# EAGLE design dev-board (EAGLE 9.6.2)
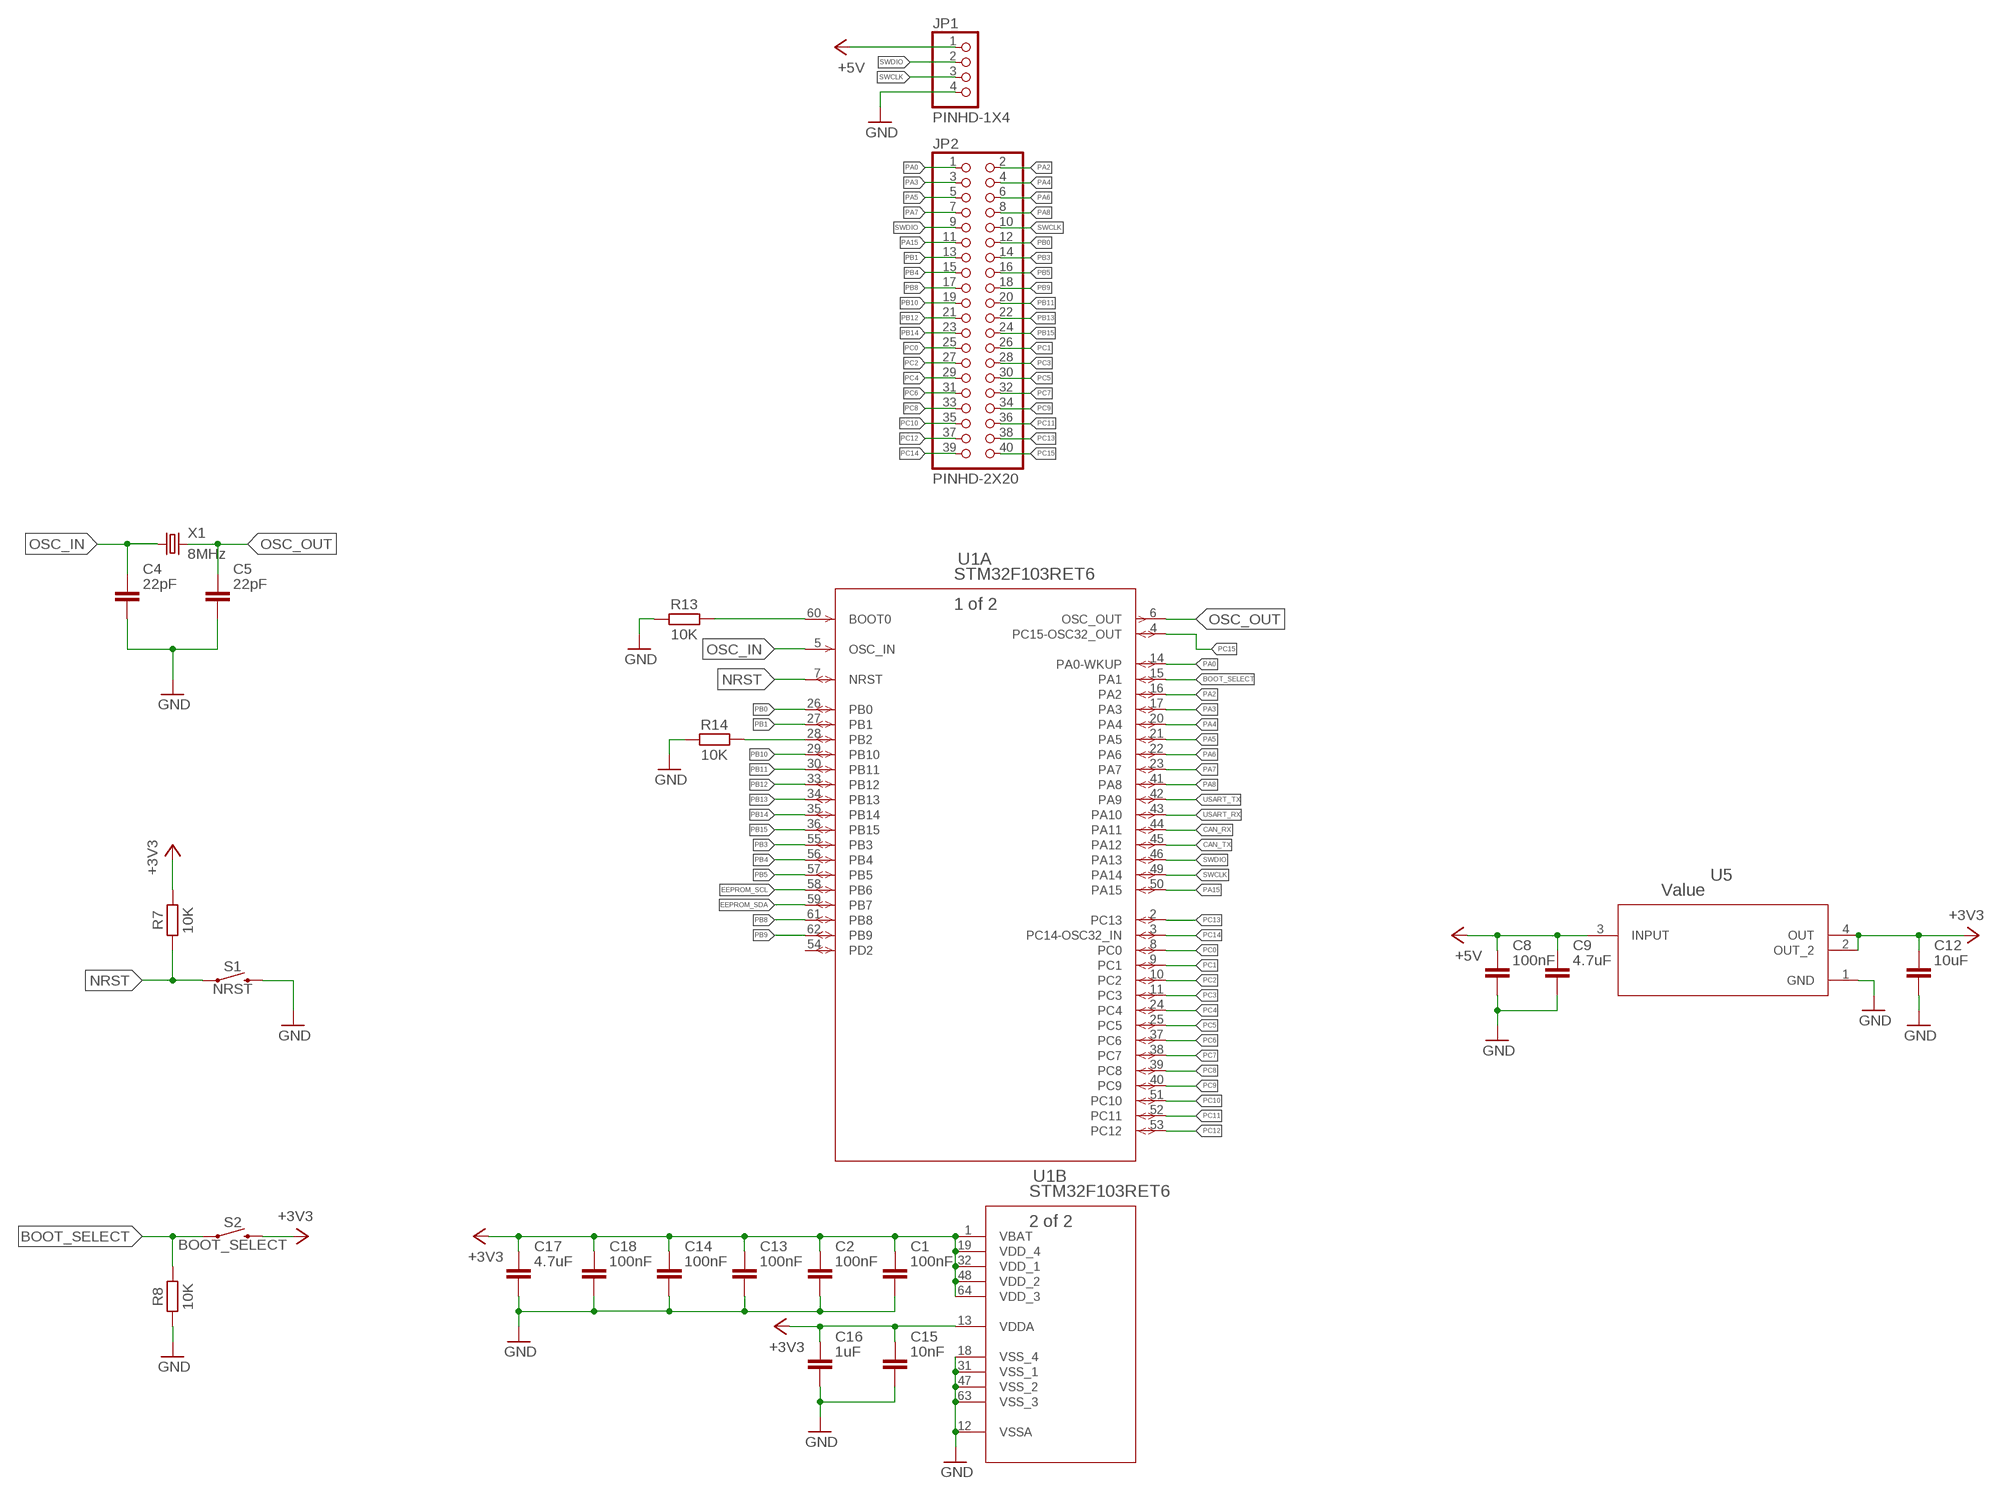
[diagram p0: schematic, sheet 1, part 1 of 2]
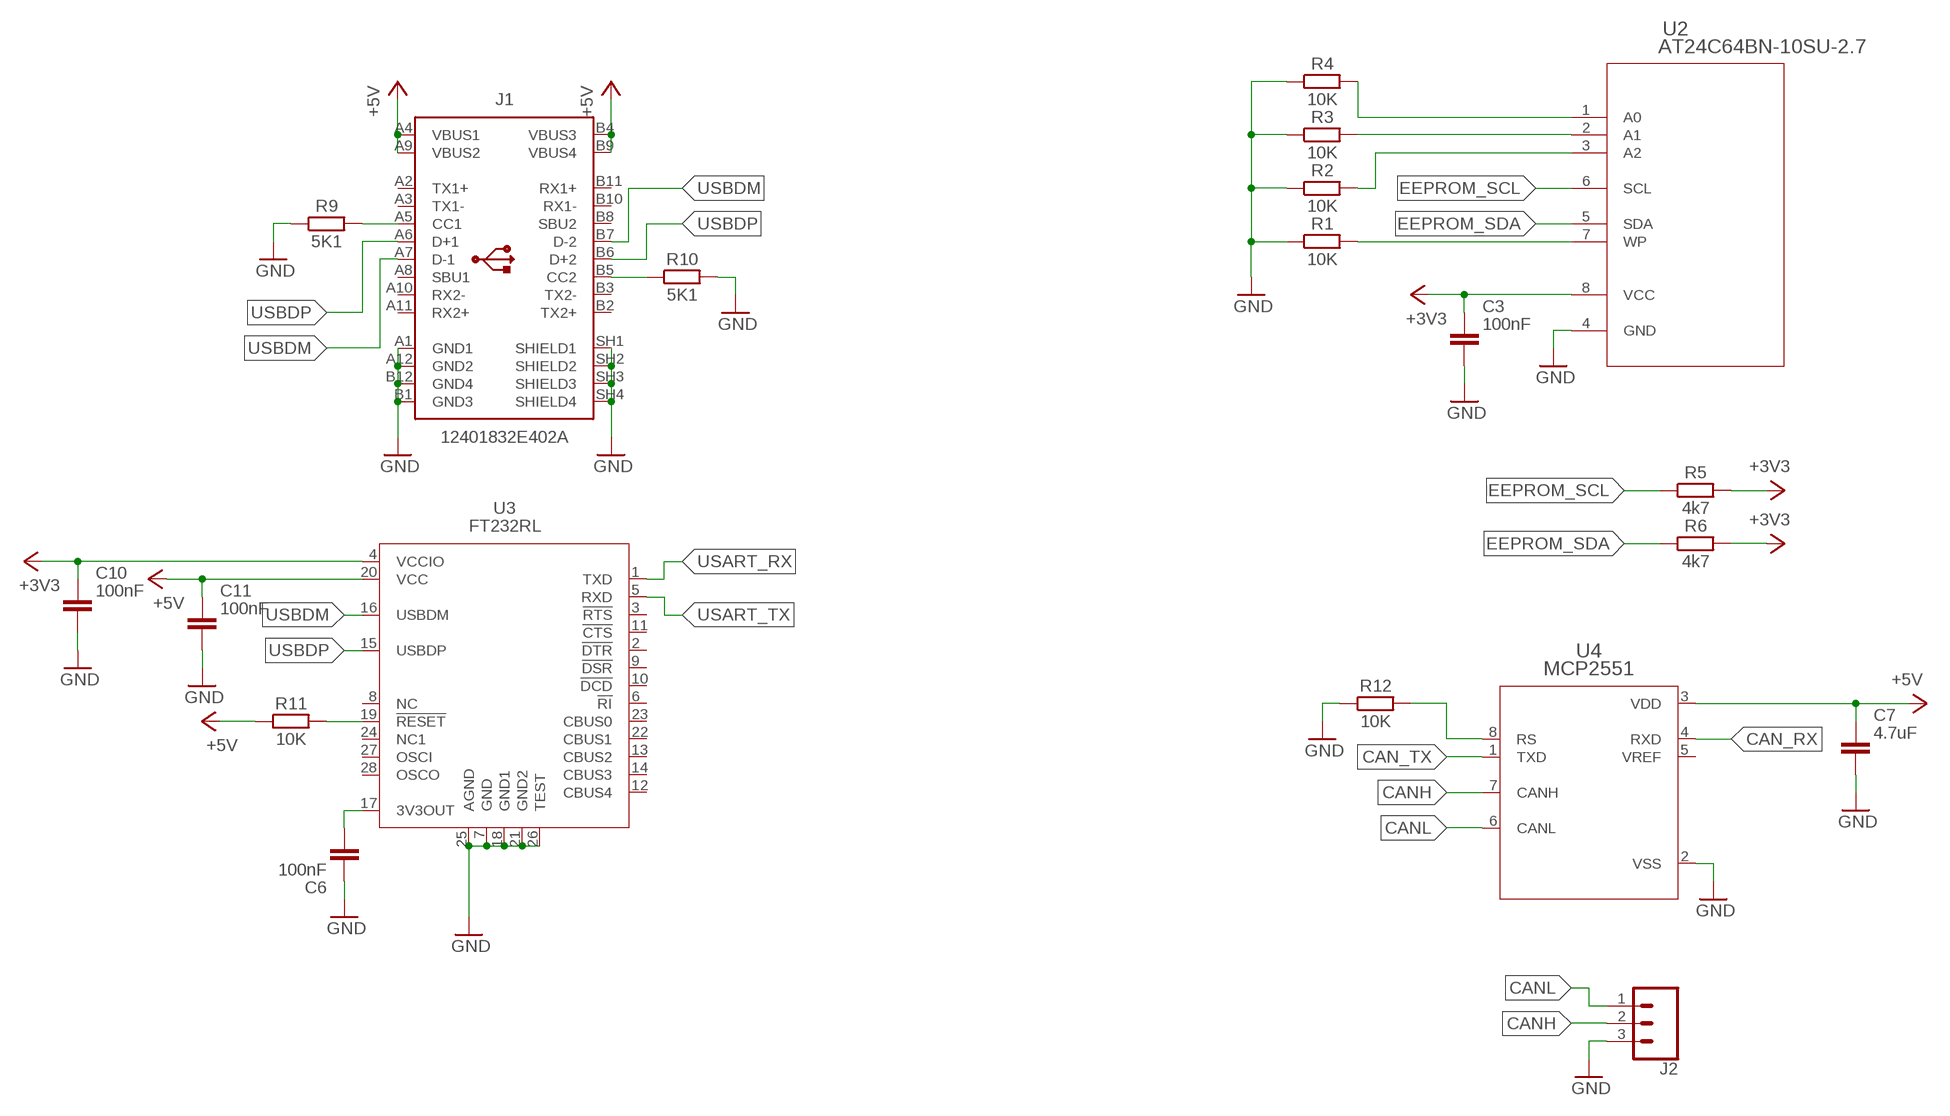
[diagram p1: schematic, sheet 1, part 2 of 2]

## Parts
C1  100nF  C_CHIP-0805(2012-METRIC)  [CAPC2012X110]
C2  100nF  C_CHIP-0805(2012-METRIC)  [CAPC2012X110]
C3  100nF  C_CHIP-0805(2012-METRIC)  [CAPC2012X110]
C4  22pF  C_CHIP-0805(2012-METRIC)  [CAPC2012X110]
C5  22pF  C_CHIP-0805(2012-METRIC)  [CAPC2012X110]
C6  100nF  C_CHIP-0805(2012-METRIC)  [CAPC2012X110]
C7  4.7uF  C_CHIP-0805(2012-METRIC)  [CAPC2012X110]
C8  100nF  C_CHIP-0805(2012-METRIC)  [CAPC2012X110]
C9  4.7uF  C_CHIP-0805(2012-METRIC)  [CAPC2012X110]
C10  100nF  C_CHIP-0805(2012-METRIC)  [CAPC2012X110]
C11  100nF  C_CHIP-0805(2012-METRIC)  [CAPC2012X110]
C12  10uF  C_CHIP-0805(2012-METRIC)  [CAPC2012X110]
C13  100nF  C_CHIP-0805(2012-METRIC)  [CAPC2012X110]
C14  100nF  C_CHIP-0805(2012-METRIC)  [CAPC2012X110]
C15  10nF  C_CHIP-0805(2012-METRIC)  [CAPC2012X110]
C16  1uF  C_CHIP-0805(2012-METRIC)  [CAPC2012X110]
C17  4.7uF  C_CHIP-0805(2012-METRIC)  [CAPC2012X110]
C18  100nF  C_CHIP-0805(2012-METRIC)  [CAPC2012X110]
J1  12401832E402A  [12401832E402A]
J2  CONN_03-SCREW-5MM  [SCREWTERMINAL-5MM-3]
JP1  PINHD-1X4  [1X04]
JP2  PINHD-2X20  [2X20]
R1  10K  R_CHIP-0805(2012-METRIC)  [RESC2012X65]
R2  10K  R_CHIP-0805(2012-METRIC)  [RESC2012X65]
R3  10K  R_CHIP-0805(2012-METRIC)  [RESC2012X65]
R4  10K  R_CHIP-0805(2012-METRIC)  [RESC2012X65]
R5  4k7  R_CHIP-0805(2012-METRIC)  [RESC2012X65]
R6  4k7  R_CHIP-0805(2012-METRIC)  [RESC2012X65]
R7  10K  R_CHIP-0805(2012-METRIC)  [RESC2012X65]
R8  10K  R_CHIP-0805(2012-METRIC)  [RESC2012X65]
R9  5K1  R_CHIP-0805(2012-METRIC)  [RESC2012X65]
R10  5K1  R_CHIP-0805(2012-METRIC)  [RESC2012X65]
R11  10K  R_CHIP-0805(2012-METRIC)  [RESC2012X65]
R12  10K  R_CHIP-0805(2012-METRIC)  [RESC2012X65]
R13  10K  R_CHIP-0805(2012-METRIC)  [RESC2012X65]
R14  10K  R_CHIP-0805(2012-METRIC)  [RESC2012X65]
S1  NRST  MOMENTARY-SWITCH-SPST-SMD-6.0X3.5MM  [TACTILE_SWITCH_SMD_6.0X3.5MM]
S2  BOOT_SELECT  MOMENTARY-SWITCH-SPST-SMD-6.0X3.5MM  [TACTILE_SWITCH_SMD_6.0X3.5MM]
U1  STM32F103RET6  [LQFP64-10X10MM]
U2  AT24C64BN-10SU-2.7  [8S1_ATM]
U3  FT232RL  FT232RL_SSOP  [SSOP28]
U4  MCP2551  MCP2551_SOIC  [SOIC127P599X175-8]
U5  Value  LM1117IMP-3.3/NOPB  [DCY0004A_N]
X1  8MHz  CRYSTALS-NOGND-4-HSMX  [HC49-4-HSMX]

## Nets
+3V3: C1.1 C2.1 C3.1 C10.1 C12.1 C13.1 C14.1 C15.1 C16.1 C17.1 C18.1 R5.2 R6.2 R7.2 S2.2 U1.1(B:VBAT) U1.13(B:VDDA) U1.19(B:VDD_4) U1.32(B:VDD_1) U1.48(B:VDD_2) U1.64(B:VDD_3) U2.8(VCC) U3.4(VCCIO) U5.2(OUT_2) U5.4(OUT)
+5V: C7.1 C8.1 C9.1 C11.1 J1.A4(VBUS1) J1.A9(VBUS2) J1.B4(VBUS3) J1.B9(VBUS4) JP1.1 R11.1 U3.20(VCC) U4.3(VDD) U5.3(INPUT)
BOOT_SELECT: R8.2 S2.1 U1.15(A:PA1)
CAN_RX: U1.44(A:PA11) U4.4(RXD)
CAN_TX: U1.45(A:PA12) U4.1(TXD)
CANH: J2.2 U4.7(CANH)
CANL: J2.1 U4.6(CANL)
EEPROM_SCL: R5.1 U1.58(A:PB6) U2.6(SCL)
EEPROM_SDA: R6.1 U1.59(A:PB7) U2.5(SDA)
GND: C1.2 C2.2 C3.2 C4.2 C5.2 C6.1 C7.2 C8.2 C9.2 C10.2 C11.2 C12.2 C13.2 C14.2 C15.2 C16.2 C17.2 C18.2 J1.A1(GND1) J1.A12(GND2) J1.B1(GND3) J1.B12(GND4) J1.SH1(SHIELD1) J1.SH2(SHIELD2) J1.SH3(SHIELD3) J1.SH4(SHIELD4) J2.3 JP1.4 R1.1 R2.1 R3.1 R4.1 R8.1 R9.1 R10.2 R12.1 R13.1 R14.1 S1.2 U1.12(B:VSSA) U1.18(B:VSS_4) U1.31(B:VSS_1) U1.47(B:VSS_2) U1.63(B:VSS_3) U2.4(GND) U3.7(GND) U3.18(GND1) U3.21(GND2) U3.25(AGND) U3.26(TEST) U4.2(VSS) U5.1(GND)
N$1: R2.2 U2.3(A2)
N$2: R3.2 U2.2(A1)
N$3: R4.2 U2.1(A0)
N$4: R1.2 U2.7(WP)
N$5: R12.2 U4.8(RS)
N$6: R14.2 U1.28(A:PB2)
N$9: R13.2 U1.60(A:BOOT0)
N$10: C6.2 U3.17(3V3OUT)
N$13: J1.A5(CC1) R9.2
N$15: R11.2 U3.19(!RESET)
N$17: J1.B5(CC2) R10.1
NRST: R7.1 S1.1 U1.7(A:NRST)
OSC_IN: C4.1 U1.5(A:OSC_IN) X1.1
OSC_OUT: C5.1 U1.6(A:OSC_OUT) X1.2
PA0: JP2.1 U1.14(A:PA0-WKUP)
PA2: JP2.2 U1.16(A:PA2)
PA3: JP2.3 U1.17(A:PA3)
PA4: JP2.4 U1.20(A:PA4)
PA5: JP2.5 U1.21(A:PA5)
PA6: JP2.6 U1.22(A:PA6)
PA7: JP2.7 U1.23(A:PA7)
PA8: JP2.8 U1.41(A:PA8)
PA15: JP2.11 U1.50(A:PA15)
PB0: JP2.12 U1.26(A:PB0)
PB1: JP2.13 U1.27(A:PB1)
PB3: JP2.14 U1.55(A:PB3)
PB4: JP2.15 U1.56(A:PB4)
PB5: JP2.16 U1.57(A:PB5)
PB8: JP2.17 U1.61(A:PB8)
PB9: JP2.18 U1.62(A:PB9)
PB10: JP2.19 U1.29(A:PB10)
PB11: JP2.20 U1.30(A:PB11)
PB12: JP2.21 U1.33(A:PB12)
PB13: JP2.22 U1.34(A:PB13)
PB14: JP2.23 U1.35(A:PB14)
PB15: JP2.24 U1.36(A:PB15)
PC0: JP2.25 U1.8(A:PC0)
PC1: JP2.26 U1.9(A:PC1)
PC2: JP2.27 U1.10(A:PC2)
PC3: JP2.28 U1.11(A:PC3)
PC4: JP2.29 U1.24(A:PC4)
PC5: JP2.30 U1.25(A:PC5)
PC6: JP2.31 U1.37(A:PC6)
PC7: JP2.32 U1.38(A:PC7)
PC8: JP2.33 U1.39(A:PC8)
PC9: JP2.34 U1.40(A:PC9)
PC10: JP2.35 U1.51(A:PC10)
PC11: JP2.36 U1.52(A:PC11)
PC12: JP2.37 U1.53(A:PC12)
PC13: JP2.38 U1.2(A:PC13)
PC14: JP2.39 U1.3(A:PC14-OSC32_IN)
PC15: JP2.40 U1.4(A:PC15-OSC32_OUT)
SWCLK: JP1.3 JP2.10 U1.49(A:PA14)
SWDIO: JP1.2 JP2.9 U1.46(A:PA13)
USART_RX: U1.43(A:PA10) U3.1(TXD)
USART_TX: U1.42(A:PA9) U3.5(RXD)
USBDM: J1.A7(D-1) J1.B7(D-2) U3.16(USBDM)
USBDP: J1.A6(D+1) J1.B6(D+2) U3.15(USBDP)
Unconnected: J1.A2(TX1+) J1.A3(TX1-) J1.A8(SBU1) J1.A10(RX2-) J1.A11(RX2+) J1.B2(TX2+) J1.B3(TX2-) J1.B8(SBU2) J1.B10(RX1-) J1.B11(RX1+) U1.54(A:PD2) U3.2(!DTR) U3.3(!RTS) U3.6(!RI) U3.8(NC) U3.9(!DSR) U3.10(!DCD) U3.11(!CTS) U3.12(CBUS4) U3.13(CBUS2) U3.14(CBUS3) U3.22(CBUS1) U3.23(CBUS0) U3.24(NC1) U3.27(OSCI) U3.28(OSCO) U4.5(VREF)

## Library data of the parts
C1-C18 = Capacitor:C: Capacitor - Generic; CATEGORY: Capacitor
J1 = Connector_USB:12401832E402A: USB(3.1) Type-C, RCPT, 24POS, SMD-THT-R/A Datasheet <https://cdn.amphenol-icc.com/media/wysiwyg/files/documentation/datasheet/inputoutput/io_usb_type_c.pdf> Drawing <https://cdn.amphenol-icc.com/media/wysiwyg/files/drawing/c12401832e402a.pdf>; CATEGORY: Connector; CONTACTS: 24; CURRENT_RATING: 5A; DESCRIPTION: CONN RCP USB3.1 TYPEC 24P SMD RA; GENDER: Receptacle; MANUFACTURER: Amphenol ICC; MOUNT_TYPE: R/A; MPN: 12401832E402A; PART_STATUS: Active; ROHS_COMPLIANT: COMPLIANT; SUB-CATEGORY: USB; TYPE: USB-C
J2 = SparkFun-Connectors:CONN_03: Multi connection point. Often used as Generic Header-pin footprint for 0.1 inch spaced/style header connections On any of the 0.1 inch spaced packages, you can populate with these: Break Away Headers - Straight (PRT-00116) Break Away Male Headers - Right Angle (PRT-00553) Female Headers (PRT-00115) Break Away Headers - Machine Pin (PRT-00117) Break Away Female Headers - Swiss Machine Pin (PRT-00743) Stackable Header - 3 Pin (Female, 0.1") (PRT-13875) For SCREWTERMINALS and SPRING TERMINALS visit here: Screw Terimnals on SparkFun.com (5mm/3.5mm/2.54mm spacing) This device is also useful as a general connection point to wire up your design to another part of your project. Our various solder wires solder well into these plated through hole pads. Hook-Up Wire - Assortment (Stranded, 22 AWG) (PRT-11375) Hook-Up Wire - Assortment (Solid Core, 22 AWG) (PRT-11367) View the entire wire category on our website here Special notes: Molex polarized connector foot print use with SKU : PRT-08232 with associated crimp pins and housings.; PROD_ID: CONN-10134; SF_SKU: PRT-08433
JP1 = Connector:PINHD-1X4: PIN HEADER; CATEGORY: CONNECTOR; SUB-CATEGORY: PIN-HEADER
JP2 = Connector:PINHD-2X20: PIN HEADER; CATEGORY: CONNECTOR; SUB-CATEGORY: PIN-HEADER
R1-R14 = Resistor:R: Resistor Fixed - Generic; CATEGORY: Resistor; SUB-CATEGORY: Fixed
S1 S2 = SparkFun-Switches:MOMENTARY-SWITCH-SPST: Momentary Switch (Pushbutton) - SPST Normally-open (NO) SPST momentary switches (buttons, pushbuttons). Variants PTH-12MM - 12mm square, through-hole Momentary Pushbutton Switch - 12mm Square (COM-09190) PTH-6.0MM, PTH-6.0MM-KIT - 6.0mm square, through-hole Mini Pushbutton Switch (COM-00097) KIT package intended for soldering kit's - only one side of pads' copper is exposed. PTH-RIGHT-ANGLE-KIT - Right-angle, through-hole Right Angle Tactile Button - Used on SparkFun BigTime Watch Kit SMD-12MM - 12mm square, surface-mount Tactile Button - SMD (12mm) (COM-12993) Used on SparkFun PicoBoard SMD-4.5MM - 4.5mm Square Trackball Switch Used on SparkFun Blackberry Trackballer Breakout SMD-4.6MMX2.8MM - 4.60mm x 2.80mm, surface mount Used on SparkFun SAMD21 Mini Breakout SMD-5.2MM, SMD-5.2-REDUNDANT - 5.2mm square, surface-mount Mini Pushbutton Switch - SMD (COM-08720) Used on Arduino Pro Mini REDUNDANT package connects both switch circuits together SMD-6.0X3.5MM - 6.0 x 3.5mm, surface mount Momentary Reset Switch SMD (COM-08229) SMD-6.2MM-TALL - 6.2mm square, surface mount Tactile Button - SMD (6mm) Used on SparkFun Digital Sandbox SMD-RIGHT-ANGLE - Right-angle, surface mount Used on SparkFun Block for Intel® Edison - Arduino; PROD_ID: SWCH-00815; SF_SKU: COM-08229
U1 = STM32F103RET6:STM32F103RET6; BUILT_BY: EMA_UL_Team; COPYRIGHT: Copyright (C) 2018 Accelerated Designs. All rights reserved; MANUFACTURER_PART_NUMBER: STM32F103RET6; SOURCELIBRARY: Updates_to_database_2020-10-19; VENDOR: STMicroelectronics
U2 = AT24C64BN-10SU:AT24C64BN-10SU-2.7; BUILT_BY: EMA_UL_Team; MANUFACTURER_PART_NUMBER: AT24C64BN-10SU-2.7; SOURCELIBRARY: Atmel_2015-02-13; VENDOR: Atmel
U3 = IC_Interface:FT232RL: USB Bridge, USB to UART USB 2.0 UART Interface Datasheet; CATEGORY: IC_Interface; MANUFACTURER: FTDI Chip; MPN: FT232RL; OPERATING_TEMP: -40 to 85°C; PART_STATUS: Active; ROHS_COMPLIANT: Compliant; SUB-CATEGORY: Controller; THERMALLOSS: 0.5W; TYPE: USB to UART
U4 = IC_Interface:MCP2551: High - Speed CAN Transceiver Datasheet; CATEGORY: IC_Interface; MANUFACTURER: Microchip; MPN: MCP2551-E/SN; OPERATING_TEMP: -40 to +125 °C; PART_STATUS: Active; SUB-CATEGORY: Transceiver
U5 = LM1117IMP-3.3:LM1117IMP-3.3/NOPB; MANUFACTURER: Texas Instruments; PARTNUMBER: LM1117IMP-3.3/NOPB; REFDES: RefDes; TYPE: TYPE
X1 = IQD-Frequency-Products:CRYSTALS-NOGND: CRYSTALS CAN NOT GROUNDED

## Board
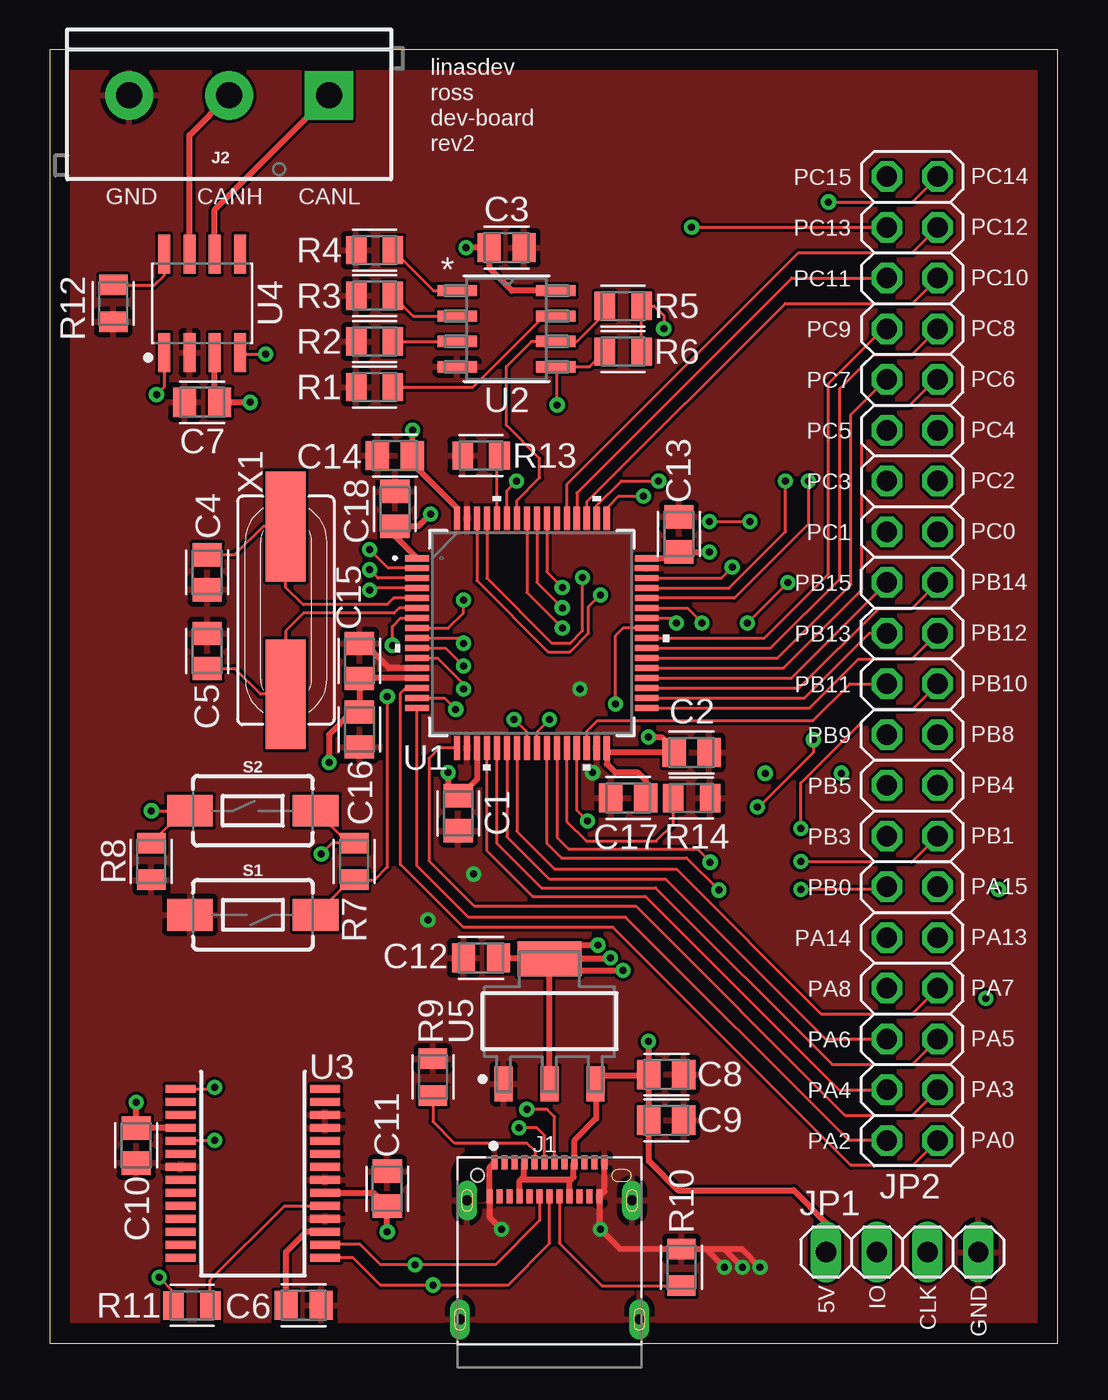
[diagram p2: board, top side]
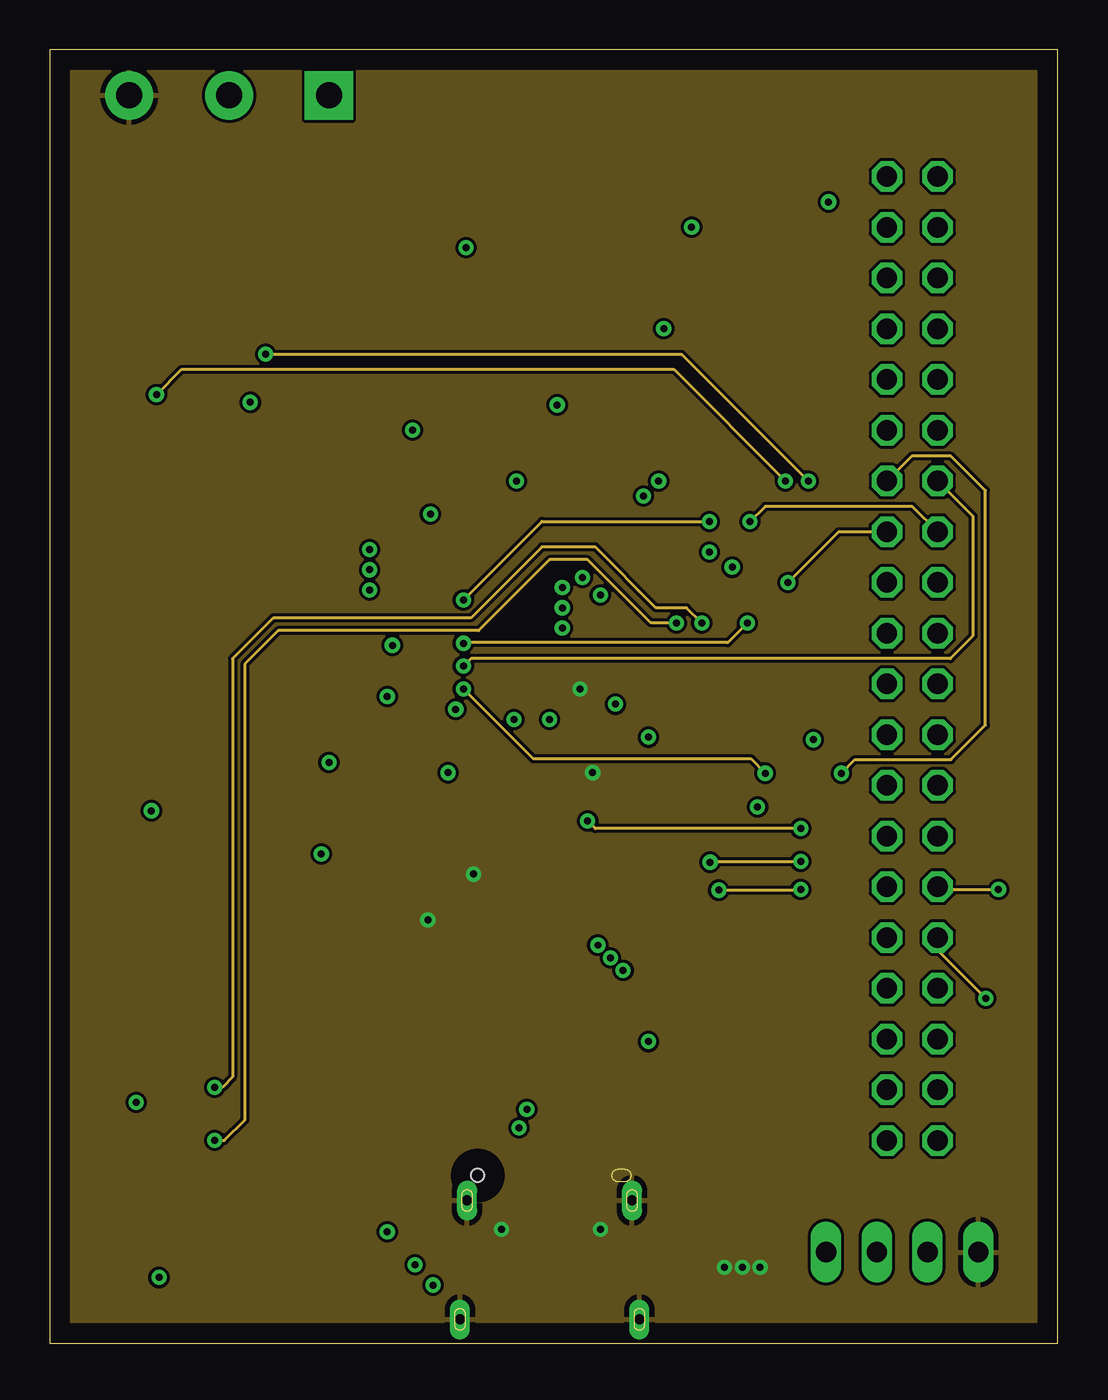
[diagram p3: board, inner layer Route2]
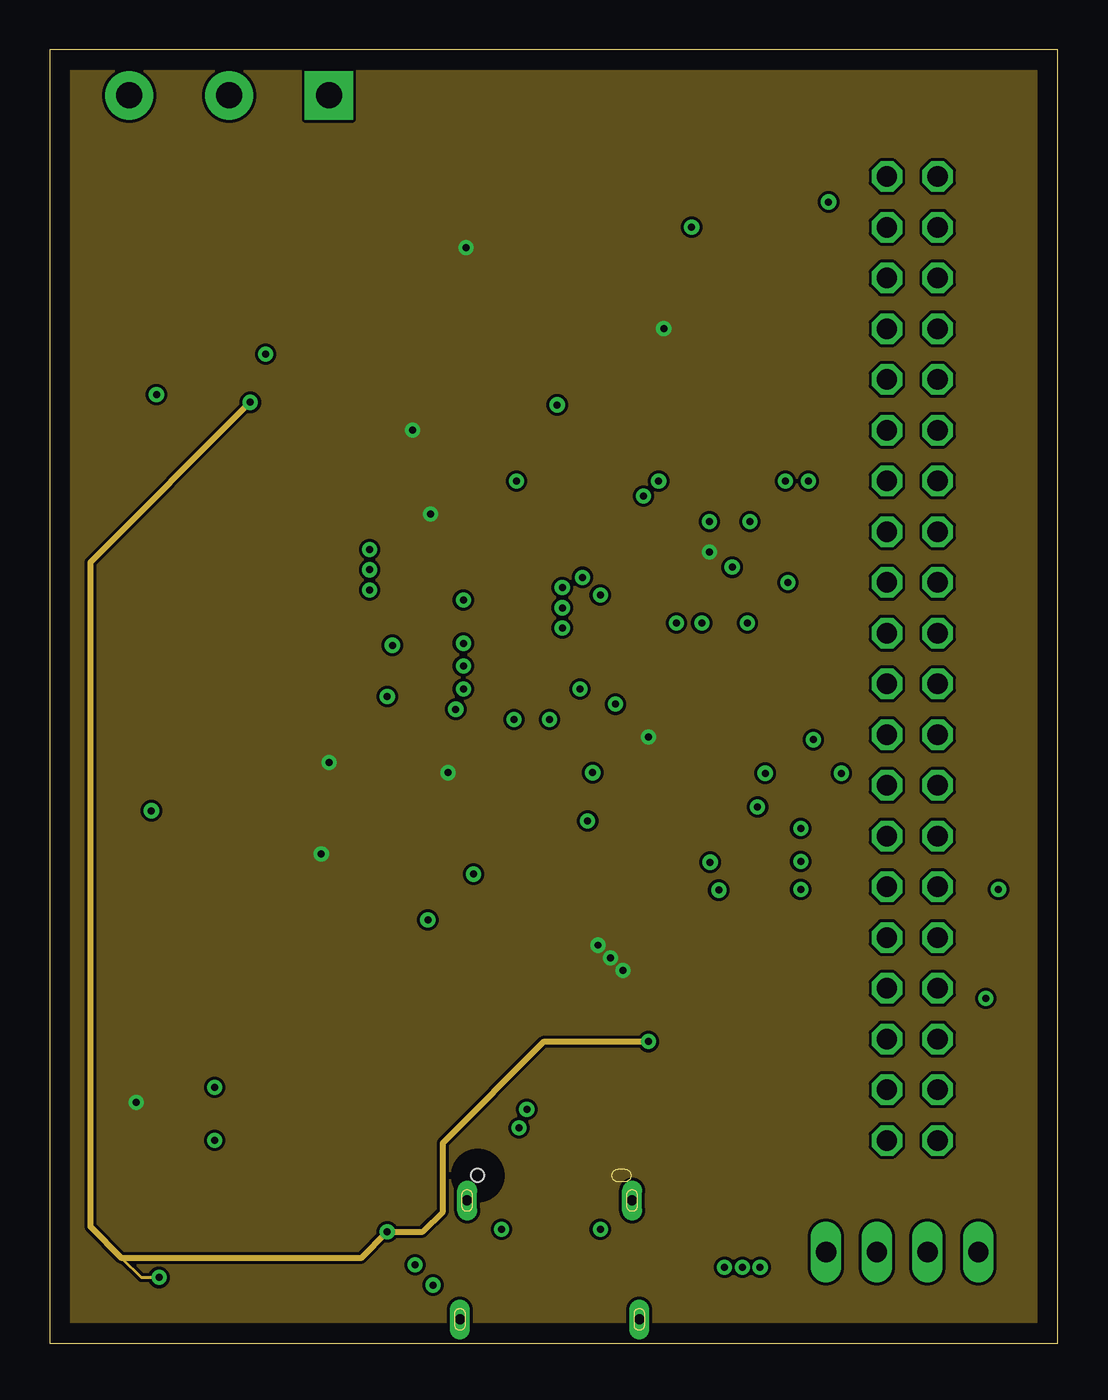
[diagram p4: board, inner layer Route15]
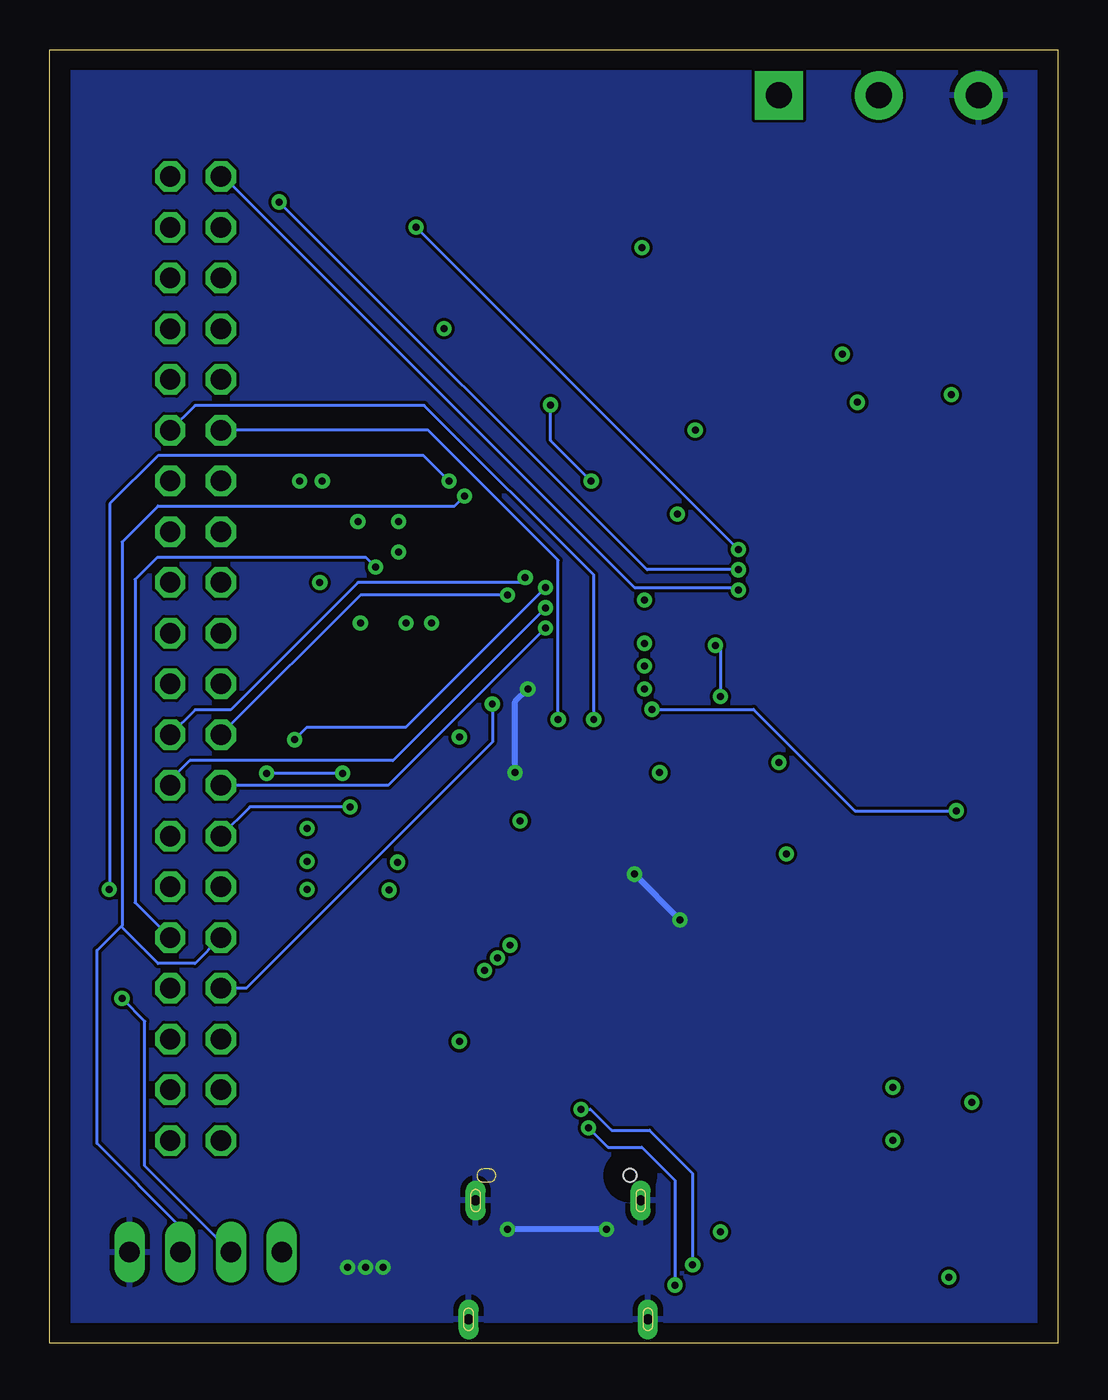
[diagram p5: board, bottom side, seen from below]

Size 50.47 x 64.76 mm. Coordinates in mm from the lower left corner, seen from the top.
Outline: 0,0 50.47,0 50.47,64.76 0,64.76 0,0
Copper layers (1+2*15+16): Top 0.035mm / dielectric 0.2mm / Route2 0.0175mm / dielectric 1.065mm / Route15 0.0175mm / dielectric 0.2mm / Bottom 0.035mm
Design rules "default *": minimum track width 6mil, minimum drill 0.35mm, track to track 6mil, track to pad 6mil, pad to pad 6mil, via to via 6mil, smd to smd 6mil, copper to edge 40mil, drill to drill 6mil, minimum pad ring 10mil, minimum via ring 8mil, stop-mask expansion 4mil, vias tented up to drill 0mil, thermal gap 10mil

### Footprints (pad centres in the part's own frame; a part is rotated, then mirrored left to right if it is on the bottom)
CAPC2012X110 = smd 1.165 x 1.465: 1 -0.875,0; 2 0.875,0
12401832E402A = smd 0.3 x 0.7: A1 -2.75,5; A2 -2.25,5; A3 -1.75,5; A4 -1.25,5; A5 -0.75,5; A6 -0.25,5; A7 0.25,5; A8 0.75,5; A9 1.25,5; A10 1.75,5; A11 2.25,5; A12 2.75,5; B1 2.5,3.3; B2 2,3.3; B3 1.5,3.3; B4 1,3.3; B5 0.5,3.3; B6 0,3.3; B7 -0.5,3.3; B8 -1,3.3; B9 -1.5,3.3; B10 -2,3.3; B11 -2.5,3.3; B12 -3,3.3 | drill 0.5 pad 0.8 long: SH1 -4.13,3.09; SH2 4.13,3.09; SH3 4.49,-2.86; SH4 -4.49,-2.86 | hole 0.65: -3.6,4.34
SCREWTERMINAL-5MM-3 = drill 1.3 pad 2.413 square: 1 0,0 | drill 1.3 pad 2.413: 2 5,0; 3 10,0
1X04 = drill 1.016 long: 1 -3.81,0; 2 -1.27,0; 3 1.27,0; 4 3.81,0
2X20 = drill 1.016 octagon: 1 -24.13,-1.27; 2 -24.13,1.27; 3 -21.59,-1.27; 4 -21.59,1.27; 5 -19.05,-1.27; 6 -19.05,1.27; 7 -16.51,-1.27; 8 -16.51,1.27; 9 -13.97,-1.27; 10 -13.97,1.27; 11 -11.43,-1.27; 12 -11.43,1.27; 13 -8.89,-1.27; 14 -8.89,1.27; 15 -6.35,-1.27; 16 -6.35,1.27; 17 -3.81,-1.27; 18 -3.81,1.27; 19 -1.27,-1.27; 20 -1.27,1.27; 21 1.27,-1.27; 22 1.27,1.27; 23 3.81,-1.27; 24 3.81,1.27; 25 6.35,-1.27; 26 6.35,1.27; 27 8.89,-1.27; 28 8.89,1.27; 29 11.43,-1.27; 30 11.43,1.27; 31 13.97,-1.27; 32 13.97,1.27; 33 16.51,-1.27; 34 16.51,1.27; 35 19.05,-1.27; 36 19.05,1.27; 37 21.59,-1.27; 38 21.59,1.27; 39 24.13,-1.27; 40 24.13,1.27
RESC2012X65 = smd 1.031 x 1.42: 1 -0.919,0; 2 0.919,0
TACTILE_SWITCH_SMD_6.0X3.5MM = smd 2.3 x 1.6: 1 -3.15,0; 2 3.15,0
LQFP64-10X10MM = smd 1.194 x 0.305: 1 -5.75,3.75; 2 -5.75,3.25; 3 -5.75,2.75; 4 -5.75,2.25; 5 -5.75,1.75; 6 -5.75,1.25; 7 -5.75,0.75; 8 -5.75,0.25; 9 -5.75,-0.25; 10 -5.75,-0.75; 11 -5.75,-1.25; 12 -5.75,-1.75; 13 -5.75,-2.25; 14 -5.75,-2.75; 15 -5.75,-3.25; 16 -5.75,-3.75; 33 5.75,-3.75; 34 5.75,-3.25; 35 5.75,-2.75; 36 5.75,-2.25; 37 5.75,-1.75; 38 5.75,-1.25; 39 5.75,-0.75; 40 5.75,-0.25; 41 5.75,0.25; 42 5.75,0.75; 43 5.75,1.25; 44 5.75,1.75; 45 5.75,2.25; 46 5.75,2.75; 47 5.75,3.25; 48 5.75,3.75 | smd 0.305 x 1.194: 17 -3.75,-5.75; 18 -3.25,-5.75; 19 -2.75,-5.75; 20 -2.25,-5.75; 21 -1.75,-5.75; 22 -1.25,-5.75; 23 -0.75,-5.75; 24 -0.25,-5.75; 25 0.25,-5.75; 26 0.75,-5.75; 27 1.25,-5.75; 28 1.75,-5.75; 29 2.25,-5.75; 30 2.75,-5.75; 31 3.25,-5.75; 32 3.75,-5.75; 49 3.75,5.75; 50 3.25,5.75; 51 2.75,5.75; 52 2.25,5.75; 53 1.75,5.75; 54 1.25,5.75; 55 0.75,5.75; 56 0.25,5.75; 57 -0.25,5.75; 58 -0.75,5.75; 59 -1.25,5.75; 60 -1.75,5.75; 61 -2.25,5.75; 62 -2.75,5.75; 63 -3.25,5.75; 64 -3.75,5.75
8S1_ATM = smd 1.981 x 0.561: 1 -2.465,1.905; 2 -2.465,0.635; 3 -2.465,-0.635; 4 -2.465,-1.905; 5 2.465,-1.905; 6 2.465,-0.635; 7 2.465,0.635; 8 2.465,1.905
SSOP28 = smd 0.4 x 1.5: 1 -4.225,-3.625; 2 -3.575,-3.625; 3 -2.925,-3.625; 4 -2.275,-3.625; 5 -1.625,-3.625; 6 -0.975,-3.625; 7 -0.325,-3.625; 8 0.325,-3.625; 9 0.975,-3.625; 10 1.625,-3.625; 11 2.275,-3.625; 12 2.925,-3.625; 13 3.575,-3.625; 14 4.225,-3.625; 15 4.225,3.625; 16 3.575,3.625; 17 2.925,3.625; 18 2.275,3.625; 19 1.625,3.625; 20 0.975,3.625; 21 0.325,3.625; 22 -0.325,3.625; 23 -0.975,3.625; 24 -1.625,3.625; 25 -2.275,3.625; 26 -2.925,3.625; 27 -3.575,3.625; 28 -4.225,3.625
SOIC127P599X175-8 = smd 1.967 x 0.599: 1 -2.469,1.905; 2 -2.469,0.635; 3 -2.469,-0.635; 4 -2.469,-1.905; 5 2.469,-1.905; 6 2.469,-0.635; 7 2.469,0.635; 8 2.469,1.905
DCY0004A_N = smd 1.75 x 0.9: 1 -3.125,2.3; 2 -3.125,0; 3 -3.125,-2.3 | smd 1.75 x 3.2: 4 3.125,0
HC49-4-HSMX = smd 5.5 x 2: 1 -4.2,0; 2 4.2,0

### Placement (x,y rotation side)
C1  20.45,26.54 270 top
C2  32.13,29.59 0 top
C3  22.86,54.86 0 top
C4  7.87,38.61 270 top
C5  7.87,34.67 90 top
C6  12.7,1.91 180 top
C7  7.62,47.12 180 top
C8  30.86,13.46 0 top
C9  30.86,11.18 0 top
C10  4.32,9.91 270 top
C11  16.89,7.75 90 top
C12  21.59,19.3 180 top
C13  31.5,40.51 90 top
C14  17.27,44.45 180 top
C15  15.49,34.16 90 top
C16  15.49,30.73 270 top
C17  28.96,27.3 180 top
C18  17.27,41.78 90 top
J1  25.02,4.06 0 top
J2  13.97,62.48 180 top
JP1  42.67,4.57 0 top
JP2  43.18,34.29 90 top
R1  16.26,47.88 0 top
R2  16.26,50.16 0 top
R3  16.26,52.45 0 top
R4  16.26,54.74 0 top
R5  28.7,51.94 0 top
R6  28.7,49.66 0 top
R7  15.24,24.13 90 top
R8  5.08,24.13 90 top
R9  19.18,13.34 270 top
R10  31.62,3.81 90 top
R11  7.11,1.91 0 top
R12  3.17,52.07 90 top
R13  21.59,44.45 0 top
R14  32.13,27.3 180 top
S1  10.16,21.46 180 top
S2  10.16,26.67 0 top
U1  24.13,35.56 0 top
U2  22.86,50.8 0 top
U3  10.16,8.51 270 top
U4  7.62,52.07 90 top
U5  25.02,16.13 90 top
X1  11.81,36.7 270 top

### Tracks (layer width: path | path; a pad name or v marks a point on that pad's centre or on a via)
+3V3  (via drill 0.35)
  Top 0.152: S2.2 14.93,25.05 | R7.2 14.13,25.05 v13.59,24.51 | R6.2 R5.2 30.26,51.94 30.73,51.47 v30.73,50.8
  Top 0.305: v4.32,12.06 C10.1 U3.4 | 14.93,25.05 R7.2 | U2.8 23.13,52.7 21.98,53.85 C3.1 v20.83,54.86 | U1.64 20.38,41.82 18.15,44.05 C14.1 18.15,45.71 v18.16,45.72 | U5.2 U5.4 | U1.1 17.27,40.42 C18.1 18.43,40.91 v19.05,41.53 | U1.13 15.52,33.31 C15.1 C16.1 15.11,31.61 13.97,30.47 v13.97,29.08 | v19.94,28.57 19.94,27.55 20.07,27.42 C1.1 20.57,27.42 21.38,28.22 U1.19 | v29.97,30.35 30.62,30.35 31.26,29.72 C2.1 27.88,29.59 U1.32 27.88,29 28.31,28.57 29.45,28.57 29.83,28.19 C17.1 | U1.48 31.17,39.31 C13.1 31.51,39.62 v33.02,39.62 | C12.1 24.97,19.3 U5.4 | U5.4 25.73,19.25 | v27.43,19.94 26.42,19.94 25.73,19.25 | v28.07,19.3 28.02,19.25 25.73,19.25 | U5.4 25.32,19.25 25.91,18.67 v28.7,18.67
  pour Route15: 0,0 0,64.77 49.53,64.77 49.53,0
+5V  (via drill 0.35)
  Top 0.152: v5.46,3.3 6.19,2.57 R11.1
  Top 0.305: J1.B9 23.52,8.13 23.6,8.21 | J1.B4 26.02,8.13 26.1,8.21 | J1.A4 23.72,9.02 23.72,8.33 23.6,8.21 | 26.1,8.21 26.22,8.33 26.22,9.02 J1.A9 26.27,10.18 27.35,11.26 27.35,12.97 U5.3 27.32,13.38 29.91,13.38 C8.1 | v29.97,15.11 29.99,15.1 C8.1 | JP1.1 38.86,6.05 37.24,7.67 31.45,7.67 29.99,9.13 C9.1 C8.1 | U4.3 8.25,47.36 C7.1 v10.03,47.12 | 23.6,8.21 26.1,8.21 | v16.89,5.59 C11.1 16.23,7.53 U3.20
  Route15 0.152: 3.6,4.27 4.57,3.3 v5.46,3.3
  Route15 0.305: v10.03,47.12 2.03,39.12 2.03,5.84 3.6,4.27 15.57,4.27 v16.89,5.59 18.67,5.59 19.67,6.59 19.67,10.04 24.75,15.11 v29.97,15.11
BOOT_SELECT  (via drill 0.35)
  Top 0.152: R8.2 6.7,26.67 S2.1 v5.08,26.67 | U1.15 19.76,32.31 v20.32,31.75
  Bottom 0.152: v20.32,31.75 15.24,31.75 10.16,26.67 v5.08,26.67
CAN_RX  (via drill 0.35)
  Top 0.152: U1.44 34.26,37.31 37.97,41.02 v37.97,43.18 | U4.4 9.6,49.53 v10.8,49.53
  Route2 0.152: v10.8,49.53 31.62,49.53 v37.97,43.18
CAN_TX  (via drill 0.35)
  Top 0.152: U1.45 34,37.81 36.83,40.64 v36.83,43.18 | U4.1 5.71,47.88 v5.33,47.5
  Route2 0.152: v5.33,47.5 6.6,48.77 31.24,48.77 v36.83,43.18
CANH
  Top 0.305: U4.7 6.99,60.5 J2.2
CANL
  Top 0.305: U4.6 8.25,56.77 J2.1
EEPROM_SCL
  Top 0.152: R5.1 27.78,51.56 26.39,50.16 U2.6 24.11,50.17 22.86,48.91 22.86,45.97 24.52,44.31 24.52,43.34 23.38,42.2 U1.58
EEPROM_SDA  (via drill 0.35)
  Top 0.152: U2.5 25.4,48.9 | 25.4,48.9 27.02,48.9 R6.1 | U1.59 22.88,42.69 v23.37,43.18 | v25.4,46.99 25.4,48.9
  Bottom 0.152: v23.37,43.18 25.4,45.21 v25.4,46.99
GND  (via drill 0.35)
  Top 0.305: U3.21 13.8,8.2 | J1.A1 22.02,8.81 J1.B12 22.02,6.3 v22.61,5.71 | 22.7,12.99 U5.1 | J1.A12 27.77,7.61 J1.B1 27.52,5.75 v27.56,5.71 28.54,4.73 R10.2 32.86,4.73 | 32.86,4.73 v33.78,3.81 | 32.86,4.73 33.75,4.73 | 33.75,4.73 v34.67,3.81 | 33.75,4.73 34.64,4.73 v35.56,3.81 | U1.12 16.98,33.81 15.75,35.04 C15.2
  Bottom 0.305: v22.61,5.71 v27.56,5.71 | v21.21,23.5 v18.92,21.21 | v27.18,28.57 27.18,32.13 v26.54,32.77
  pour Route2: 0,0 0,64.77 49.53,64.77 49.53,0
  pour Top: 0,64.77 49.53,64.77 49.53,0 0,0
  pour Bottom: 0,64.77 49.53,64.77 49.53,0 0,0
N$1
  Top 0.152: R2.2 U2.3
N$2
  Top 0.152: R3.2 18.19,51.44 U2.2
N$3
  Top 0.152: R4.2 19.21,52.7 U2.1
N$4
  Top 0.152: U2.7 24.75,51.44 21.19,47.88 R1.2
N$5
  Top 0.152: U4.8 5.71,53.47 5.21,52.96 3.21,52.96 R12.2
N$6
  Top 0.152: U1.28 25.87,26.14 26.86,25.15 30.35,25.15 31.21,26 R14.2
N$9
  Top 0.152: U1.60 22.38,44.32 R13.2
N$10
  Top 0.305: U3.17 12.82,5.58 11.81,4.57 C6.2
N$13
  Top 0.152: J1.A5 24.28,9.07 24.28,9.63 23.89,10.02 20.26,10.02 19.18,11.11 R9.2
N$15
  Top 0.152: R11.2 8.03,3.17 11.74,6.88 U3.19
N$17
  Top 0.152: J1.B5 25.51,5.01 27.64,2.89 R10.1
NRST  (via drill 0.35)
  Top 0.152: S1.1 15.06,23.21 R7.1 16.26,23.21 16.89,23.85 v16.89,32.38 | v17.14,34.95 17.14,35.9 17.55,36.31 U1.7
  Bottom 0.152: v16.89,32.38 16.89,34.7 v17.14,34.95
OSC_IN
  Top 0.152: C4.1 9.26,39.48 10.68,40.9 X1.1 11.81,37.85 12.68,36.98 16.89,36.98 17.21,37.31 U1.5
OSC_OUT
  Top 0.152: C5.1 9.26,33.8 10.55,32.5 X1.2 11.81,35.66 12.71,36.56 17.24,36.56 17.49,36.81 U1.6
PA0
  Top 0.152: JP2.1 43.21,8.91 40.11,8.91 28.19,20.83 20.7,20.83 17.55,23.97 17.55,32.56 17.82,32.82 U1.14
PA2
  Top 0.152: JP2.2 40.01,10.16 28.83,21.34 20.95,21.34 18.38,23.91 U1.16
PA3
  Top 0.152: U1.17 19.49,29.81 18.97,29.29 18.97,24.16 21.25,21.89 29.34,21.89 39.81,11.43 43.18,11.43 JP2.3
PA4
  Top 0.152: JP2.4 39.5,12.7 29.82,22.38 24.16,22.38 21.87,24.67 U1.20
PA5
  Top 0.152: U1.21 22.37,25.05 24.61,22.81 30.32,22.81 39.17,13.97 43.18,13.97 JP2.5
PA6
  Top 0.152: U1.22 22.88,25.36 24.99,23.24 30.83,23.24 38.84,15.24 JP2.6
PA7
  Top 0.152: U1.23 23.38,25.64 25.27,23.75 31.37,23.75 38.61,16.51 43.18,16.51 JP2.7
PA8  (via drill 0.35)
  Top 0.152: U1.41 29.31,35.82 29.31,35.81 28.7,35.81 28.32,35.43 v28.32,32
  Bottom 0.152: v28.32,32 28.32,30.1 40.64,17.78 JP2.8
PA15  (via drill 0.35)
  Top 0.152: U1.50 27.37,41.94 28.61,43.18 v30.48,43.18
  Route2 0.152: JP2.11 44.58,22.73 v47.5,22.73
  Bottom 0.152: v30.48,43.18 31.75,44.45 45.06,44.45 47.47,42.04 47.47,22.76 v47.5,22.73
PB0  (via drill 0.35)
  Top 0.152: U1.26 24.87,25.05 25.62,24.31 31.88,24.31 v33.49,22.7 | JP2.12 41.78,22.73 v37.59,22.73
  Route2 0.152: v33.49,22.7 37.55,22.7 v37.59,22.73
PB1  (via drill 0.35)
  Top 0.152: U1.27 25.4,29.79 25.4,25.34 25.97,24.77 32.41,24.77 33.07,24.11 v33.06,24.09 | JP2.13 43.16,24.11 43.13,24.13 v37.59,24.13
  Route2 0.152: v33.06,24.09 33.1,24.13 v37.59,24.13
PB3  (via drill 0.35)
  Top 0.152: U1.55 24.88,38.62 v25.65,37.85 | v38.23,30.23 38.23,29.59 35.5,26.86 v35.43,26.86
  Bottom 0.152: v25.65,37.85 32.64,30.86 37.59,30.86 v38.23,30.23 | v35.43,26.86 40.45,26.86 JP2.14
PB4  (via drill 0.35)
  Top 0.152: U1.56 24.38,38.1 v25.65,36.83
  Bottom 0.152: JP2.15 44.45,28.2 43.46,29.18 33.3,29.18 v25.65,36.83
PB5  (via drill 0.35)
  Top 0.152: U1.57 23.88,37.59 v25.65,35.81
  Bottom 0.152: v25.65,35.81 33.53,27.94 JP2.16
PB8  (via drill 0.35)
  Top 0.152: U1.61 21.88,38.32 25.15,35.05 26.04,35.05 26.67,35.69 v26.67,38.35
  Bottom 0.152: v26.67,38.35 26.92,38.1 35.05,38.1 41.42,31.73 43.21,31.73 JP2.17
PB9  (via drill 0.35)
  Top 0.152: U1.62 21.38,38.18 24.94,34.62 26.03,34.62 26.97,35.56 26.97,36.88 v27.56,37.47
  Bottom 0.152: v27.56,37.47 34.92,37.47 JP2.18
PB10  (via drill 0.35)
  Top 0.152: U1.29 26.37,26.7 v26.91,26.16 v26.92,26.16 | JP2.19 43.21,31.77 41.3,31.77 37.59,28.07 v37.59,25.78
  Route2 0.152: v37.59,25.78 27.3,25.78 v26.92,26.16
PB11
  Top 0.152: U1.30 26.87,30.63 27.42,31.18 38.21,31.18 40.05,33.02 JP2.20
PB12
  Top 0.152: JP2.21 43.16,34.27 40.48,34.27 38.03,31.81 U1.33
PB13
  Top 0.152: U1.34 37.77,32.31 41.02,35.56 JP2.22
PB14
  Top 0.152: JP2.23 43.16,36.8 41.5,36.8 37.51,32.81 U1.35
PB15
  Top 0.152: U1.36 37.12,33.31 JP2.24
PC0  (via drill 0.35)
  Top 0.152: U1.8 19.93,35.81 20.7,36.58 v20.7,37.21 | v33.02,41.15 v35.05,41.15
  Route2 0.152: v20.7,37.21 24.64,41.15 v33.02,41.15 | JP2.25 43.18,41.91 35.81,41.91 v35.05,41.15
PC1  (via drill 0.35)
  Top 0.152: U1.9 20.44,35.31 v20.7,35.05 | v34.92,36.07 v36.96,38.1
  Route2 0.152: v20.7,35.05 20.73,35.08 33.94,35.08 v34.92,36.07 | v36.96,38.1 39.5,40.64 JP2.26
PC2  (via drill 0.35)
  Top 0.152: U1.10 19.8,34.81 v20.7,33.91
  Route2 0.152: v20.7,33.91 21.08,34.29 45.09,34.29 46.23,35.43 46.23,41.4 JP2.27
PC3  (via drill 0.35)
  Top 0.152: U1.11 19.41,34.31 20.7,33.02 v20.7,32.77
  Route2 0.152: v20.7,32.77 24.19,29.27 35.09,29.27 v35.81,28.55 | JP2.28 43.15,44.42 45.11,44.42 46.84,42.7 46.84,30.96 45.11,29.23 40.31,29.23 v39.62,28.55
  Bottom 0.152: v35.81,28.55 v39.62,28.55
PC4  (via drill 0.35)
  Top 0.152: U1.24 23.88,30.6 v23.24,31.24
  Bottom 0.152: JP2.29 43.21,46.97 31.72,46.97 23.24,38.48 v23.24,31.24
PC5  (via drill 0.35)
  Top 0.152: U1.25 24.38,30.6 v25.02,31.24
  Bottom 0.152: v25.02,31.24 25.02,39.21 31.53,45.72 JP2.30
PC6
  Top 0.152: JP2.31 44.33,48.26 43.03,46.97 41.25,46.97 40.66,46.38 40.66,37.74 36.73,33.81 U1.37
PC7
  Top 0.152: JP2.32 41.86,48.26 40.11,46.51 40.11,38 36.42,34.31 U1.38
PC8
  Top 0.152: U1.39 36.08,34.81 39.55,38.28 39.55,47.81 41.25,49.51 43.16,49.51 JP2.33
PC9
  Top 0.152: U1.40 35.77,35.31 38.99,38.53 38.99,48.06 41.73,50.8 JP2.34
PC10
  Top 0.152: U1.51 26.87,42.13 36.81,52.07 43.18,52.07 JP2.35
PC11
  Top 0.152: U1.52 26.38,42.58 37.14,53.34 JP2.36
PC12
  Top 0.152: U1.53 25.87,43.01 37.48,54.61 43.18,54.61 JP2.37
PC13  (via drill 0.35)
  Top 0.152: U1.2 16.94,38.81 v16,39.75 | v32.13,55.88 JP2.38
  Bottom 0.152: v16,39.75 v32.13,55.88
PC14  (via drill 0.35)
  Top 0.152: U1.3 16.43,38.31 v16,38.73 | v38.99,57.15 43.18,57.15 JP2.39
  Bottom 0.152: v16,38.73 20.57,38.73 v38.99,57.15
PC15  (via drill 0.35)
  Top 0.152: U1.4 16.09,37.81 v16,37.72
  Bottom 0.152: v16,37.72 16.13,37.85 21.21,37.85 41.78,58.42 JP2.40
SWCLK  (via drill 0.35)
  Top 0.152: v29.72,42.42 28.48,42.42 27.96,41.89 27.96,41.39 U1.49
  Bottom 0.152: v29.72,42.42 30.2,41.94 45.06,41.94 46.86,40.13 46.86,20.92 | JP2.10 43.2,19.02 45.06,19.02 46.86,20.83 46.86,20.92 | JP1.3 43.94,5.84 48.11,10.01 48.11,19.68 46.86,20.92
SWDIO  (via drill 0.35)
  Top 0.152: v34.16,38.86 33.61,38.31 U1.46
  Route2 0.152: v46.86,17.27 44.45,19.68 JP2.9
  Bottom 0.152: v34.16,38.86 34.67,39.37 45.09,39.37 46.2,38.25 46.2,22.07 JP2.9 | JP1.2 45.72,8.89 45.72,16.13 v46.86,17.27
USART_RX  (via drill 0.35)
  Top 0.152: v32.64,36.07 32.64,36.08 31.91,36.81 U1.43 | U3.1 8.16,12.73 v8.25,12.83
  Route2 0.152: v32.64,36.07 31.88,36.83 30.35,36.83 27.3,39.88 24.64,39.88 21.08,36.32 11.18,36.32 9.14,34.29 9.14,13.34 8.64,12.83 v8.25,12.83
USART_TX  (via drill 0.35)
  Top 0.152: U1.42 31.13,36.31 v31.37,36.07 | U3.5 6.56,10.16 v8.25,10.16
  Route2 0.152: v31.37,36.07 30.1,36.07 26.92,39.24 25.02,39.24 21.46,35.69 11.43,35.69 9.75,34.01 9.75,11.18 8.73,10.16 v8.25,10.16
USBDM  (via drill 0.35)
  Top 0.152: J1.B7 24.52,6.16 22.3,3.94 v18.29,3.94 16.55,3.94 15.52,4.97 13.82,4.97 U3.16 | J1.A7 25.27,11.35 24.89,11.72 v23.88,11.72
  Bottom 0.152: v23.88,11.72 23.41,11.72 22.35,10.67 20.45,10.67 18.29,8.51 v18.29,3.94
USBDP  (via drill 0.35)
  Top 0.152: J1.A6 24.77,10.41 24.38,10.79 v23.49,10.79 | J1.B6 25.02,5.01 22.93,2.92 v19.18,2.92 16.55,2.92 16.08,3.38 15.18,4.28 U3.15
  Bottom 0.152: v23.49,10.79 22.52,9.82 20.83,9.82 19.18,8.17 v19.18,2.92

### Text on the board
tNames: linasdev | ross | dev-board | rev2 | PC15 | PC14 | GND | CANH | CANL | PC13 | PC12 | PC11 | PC10 | PC9 | PC8 | PC7 | PC6 | PC5 | PC4 | PC3 | PC2 | PC1 | PC0 | PB15 | PB14 | PB13 | PB12 | PB11 | PB10 | PB9 | PB8 | PB5 | PB4 | PB3 | PB1 | PB0 | PA15 | PA14 | PA13 | PA8 | PA7 | PA6 | PA5 | PA4 | PA3 | PA2 | PA0 | 5V | IO | CLK | GND